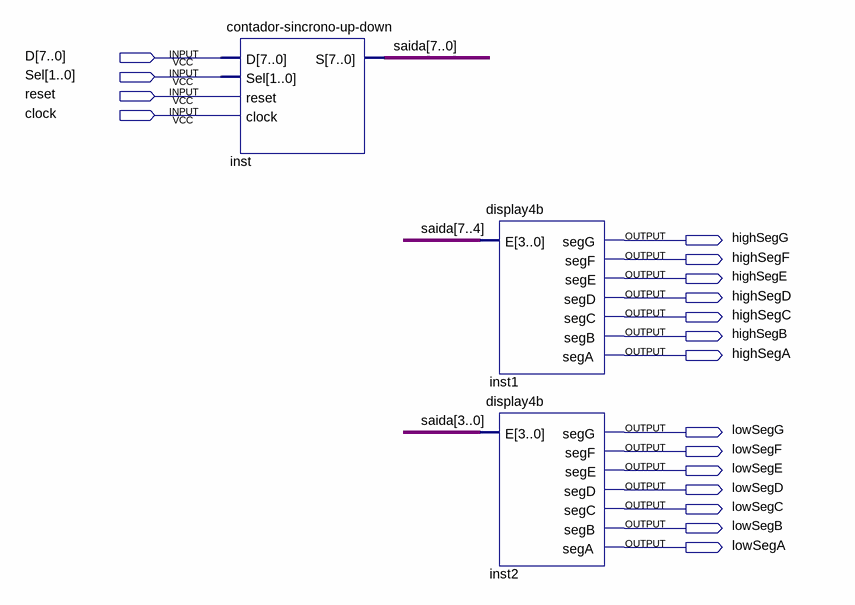
[diagram p0: schematic sheet]
// Quartus schematic contador-com-saida.bdf as structural Verilog: 3 symbols, 18 pins
module \contador-com-saida  (
  input  [7:0] D,
  input  [1:0] Sel,
  input  reset,
  input  clock,
  output highSegG,
  output highSegF,
  output highSegE,
  output highSegD,
  output highSegC,
  output highSegB,
  output highSegA,
  output lowSegG,
  output lowSegF,
  output lowSegE,
  output lowSegD,
  output lowSegC,
  output lowSegB,
  output lowSegA
);

  wire [7:0] saida;

  \contador-sincrono-up-down  inst (.D(D), .Sel(Sel), .reset(reset), .clock(clock), .S(saida));
  display4b inst1 (
    .E(saida[7:4]), .segG(highSegG), .segF(highSegF), .segE(highSegE), .segD(highSegD), .segC(highSegC),
    .segB(highSegB), .segA(highSegA));
  display4b inst2 (
    .E(saida[3:0]), .segG(lowSegG), .segF(lowSegF), .segE(lowSegE), .segD(lowSegD), .segC(lowSegC),
    .segB(lowSegB), .segA(lowSegA));
endmodule
